# Altium schematic sheet RGB棒.SchDoc
size A4
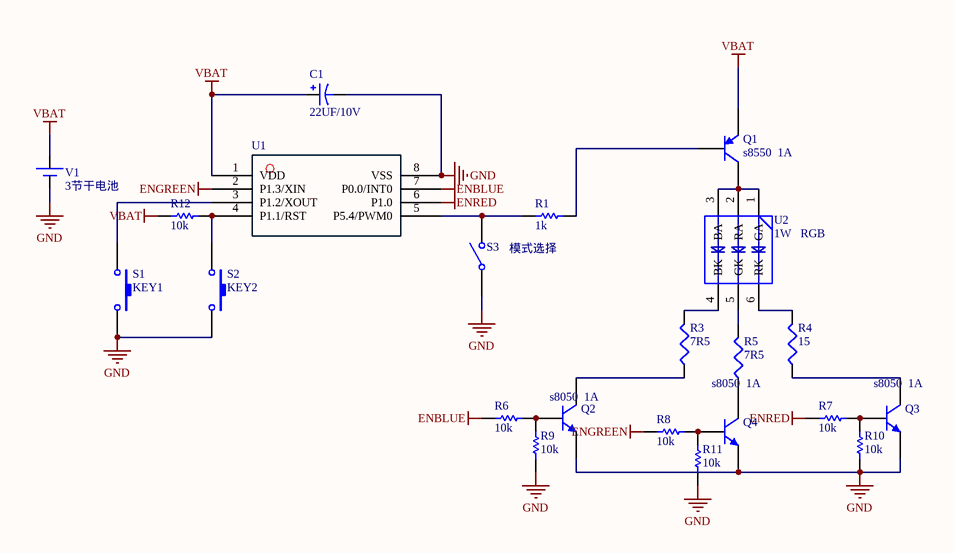
[diagram p0: RGB棒.SchDoc]

## Parts
C1  22UF/10V  [R0805-S]
Q1  s8550  1A  [3906_SOT23]
Q2  s8050  1A  [3904_SOT23]
Q3  s8050  1A  [3904_SOT23]
Q4  s8050  1A  [3904_SOT23]
R1  1k  [R0603-s]
R3  7R5  [R1206S]
R4  15  [R1206S]
R5  7R5  [R1206S]
R6  10k  [R0603-s]
R7  10k  [R0603-s]
R8  10k  [R0603-s]
R9  10k  [R0603-s]
R10  10k  [R0603-s]
R11  10k  [R0603-s]
R12  10k  [R0603-s]
S1  KEY1  [SW-H - duplicate]
S2  KEY2  [SW-H - duplicate]
S3  SW-SPST  [SPST-2]  (value not drawn)
U1  (no value)  [SO14]
U2  1W   RGB  [LED5050]
V1  3节干电池  [Model Name]

## Nets
ENBLUE: R6.1 U1.7(P0.0/INT0)
ENGREEN: R8.1 U1.2(P1.3/XIN)
ENRED: R7.1 U1.6(P1.0)
GND: C1.2 Q2.1(E) Q3.1(E) Q4.1(E) R9.1 R10.1 R11.1 S1.2 S2.2 S3.1(COMMON) U1.8(VSS) V1.2(N)
VBAT: C1.1 Q1.1(E) R12.2 U1.1(VDD) V1.1(P)
NetQ1_2: Q1.2(B) R1.2
NetQ1_3: Q1.3(C) U2.1(GA) U2.2(RA) U2.3(BA)
NetQ2_2: Q2.2(B) R6.2 R9.2
NetQ2_3: Q2.3(C) R3.1
NetQ3_2: Q3.2(B) R7.2 R10.2
NetQ3_3: Q3.3(C) R4.1
NetQ4_2: Q4.2(B) R8.2 R11.2
NetQ4_3: Q4.3(C) R5.1
NetR1_1: R1.1 S3.2(NO) U1.5(P5.4/PWM0)
NetR3_2: R3.2 U2.4(BK)
NetR4_2: R4.2 U2.6(RK)
NetR5_2: R5.2 U2.5(GK)
NetR12_1: R12.1 S2.1 U1.4(P1.1/RST)
NetS1_1: S1.1 U1.3(P1.2/XOUT)

## Notes on the sheet
- 模式选择

## Library data of the parts
C1 = Cap Pol1: Polarized Capacitor (Radial); Value: 100pF; Published: 8-Jun-2000; LatestRevisionDate: 17-Jul-2002; LatestRevisionNote: Re-released for DXP Platform.; PackageReference: RB7.6-15; Publisher: Altium Limited
Q1 = 2N3906: PNP General Purpose Amplifier; pin to pad: 1>2 2>1; Published: 8-Jun-2000; LatestRevisionDate: 15-Jan-2003; LatestRevisionNote: PCB Footprint 'BCY-W3/D4.7' replaced; DatasheetDocument: 1997; PackageDocument: Sep-1998; PackageReference: TO-92A; Publisher: Altium Limited; Code_JEDEC: TO-92A
Q2-Q4 = 2N3904: NPN General Purpose Amplifier; Published: 8-Jun-2000; LatestRevisionDate: 15-Jan-2003; LatestRevisionNote: PCB Footprint 'BCY-W3/D4.7' replaced; DatasheetDocument: 1997; PackageDocument: Sep-1998; PackageReference: TO-92A; Publisher: Altium Limited; Code_JEDEC: TO-92A
R1 R6-R12 = Res1: Resistor; Published: 8-Jun-2000; LatestRevisionDate: 17-Jul-2002; LatestRevisionNote: Re-released for DXP Platform.; Publisher: Altium Limited
R3-R5 = Res3: Resistor; Published: 8-Jun-2000; LatestRevisionDate: 4-Mar-2005; LatestRevisionNote: PCB Footprint replaced.; Publisher: Altium Limited
S1 S2 = SW-PB: Switch; Published: 24-Mar-1999; LatestRevisionDate: 17-Jul-2002; LatestRevisionNote: Re-released for DXP Platform.; Publisher: Altium Limited
S3 = SW-SPST: Single-Pole, Single-Throw Switch; Published: 24-Mar-1999; LatestRevisionDate: 17-Jul-2002; LatestRevisionNote: Re-released for DXP Platform.; PackageReference: SPST-2; Publisher: Altium Limited; PackageDescription: Switch; 2 Leads
U1 = sn8p2501-8PIN
U2 = LED5050
V1 = BAT-LI